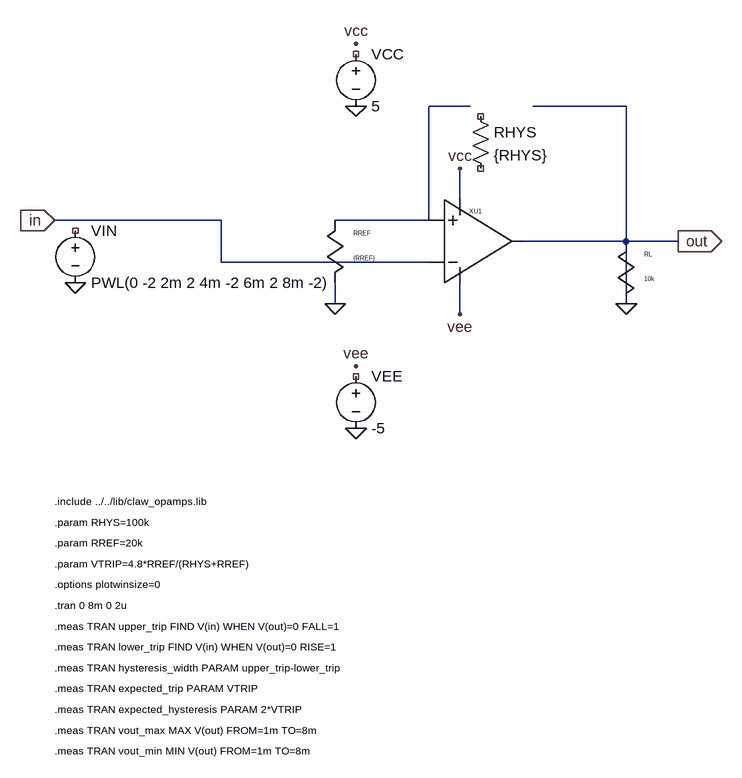
[diagram p0: schematic schmitt_trigger_simple.asc]
schmitt_trigger_simple.asc, the LTspice schematic file:
Version 4
SHEET 1 1245 1335
WIRE 64 336 320 336
WIRE 320 336 320 400
WIRE 320 400 640 400
WIRE 496 336 640 336
WIRE 640 336 640 160
WIRE 640 160 704 160
WIRE 800 160 944 160
WIRE 944 160 944 368
WIRE 784 368 1024 368
WIRE 944 368 944 464
WIRE 496 432 496 464
WIRE 688 304 688 256
WIRE 688 432 688 480
SYMBOL voltage 96 336 R0
SYMATTR InstName VIN
SYMATTR Value PWL(0 -2 2m 2 4m -2 6m 2 8m -2)
SYMBOL voltage 528 64 R0
SYMATTR InstName VCC
SYMATTR Value 5
SYMBOL voltage 528 560 R0
SYMATTR InstName VEE
SYMATTR Value -5
SYMBOL opamp2 640 304 R0
SYMATTR InstName XU1
SYMATTR Value CLAW_IDEAL_OPAMP
SYMBOL res 704 160 R0
SYMATTR InstName RHYS
SYMATTR Value {RHYS}
SYMBOL res_v 496 336 R0
SYMATTR InstName RREF
SYMATTR Value {RREF}
SYMBOL res_v 944 368 R0
SYMATTR InstName RL
SYMATTR Value 10k
FLAG 64 336 in
IOPIN 64 336 In
FLAG 1024 368 out
IOPIN 1024 368 Out
FLAG 96 432 0
FLAG 496 464 0
FLAG 944 464 0
FLAG 528 64 vcc
FLAG 528 160 0
FLAG 528 560 vee
FLAG 528 656 0
FLAG 688 256 vcc
FLAG 688 480 vee
TEXT 64 768 Left 1 !.include ../../lib/claw_opamps.lib
TEXT 64 800 Left 1 !.param RHYS=100k
TEXT 64 832 Left 1 !.param RREF=20k
TEXT 64 864 Left 1 !.param VTRIP=4.8*RREF/(RHYS+RREF)
TEXT 64 896 Left 1 !.options plotwinsize=0
TEXT 64 928 Left 1 !.tran 0 8m 0 2u
TEXT 64 960 Left 1 !.meas TRAN upper_trip FIND V(in) WHEN V(out)=0 FALL=1
TEXT 64 992 Left 1 !.meas TRAN lower_trip FIND V(in) WHEN V(out)=0 RISE=1
TEXT 64 1024 Left 1 !.meas TRAN hysteresis_width PARAM upper_trip-lower_trip
TEXT 64 1056 Left 1 !.meas TRAN expected_trip PARAM VTRIP
TEXT 64 1088 Left 1 !.meas TRAN expected_hysteresis PARAM 2*VTRIP
TEXT 64 1120 Left 1 !.meas TRAN vout_max MAX V(out) FROM=1m TO=8m
TEXT 64 1152 Left 1 !.meas TRAN vout_min MIN V(out) FROM=1m TO=8m

The netlist it stands for:
* schmitt_trigger_simple.asc
VIN NC_01 0 PWL(0 -2 2m 2 4m -2 6m 2 8m -2)
VCC NC_02 0 5
VEE NC_03 0 -5
XXU1 CLAW_IDEAL_OPAMP CLAW_IDEAL_OPAMP
RHYS NC_04 NC_05 {RHYS}
RREF N001 0 {RREF}
RL 0 0 10k
.include ../../lib/claw_opamps.lib
.param RHYS=100k
.param RREF=20k
.param VTRIP=4.8*RREF/(RHYS+RREF)
.options plotwinsize=0
.tran 0 8m 0 2u
.meas TRAN upper_trip FIND V(in) WHEN V(out)=0 FALL=1
.meas TRAN lower_trip FIND V(in) WHEN V(out)=0 RISE=1
.meas TRAN hysteresis_width PARAM upper_trip-lower_trip
.meas TRAN expected_trip PARAM VTRIP
.meas TRAN expected_hysteresis PARAM 2*VTRIP
.meas TRAN vout_max MAX V(out) FROM=1m TO=8m
.meas TRAN vout_min MIN V(out) FROM=1m TO=8m
.backanno
.end